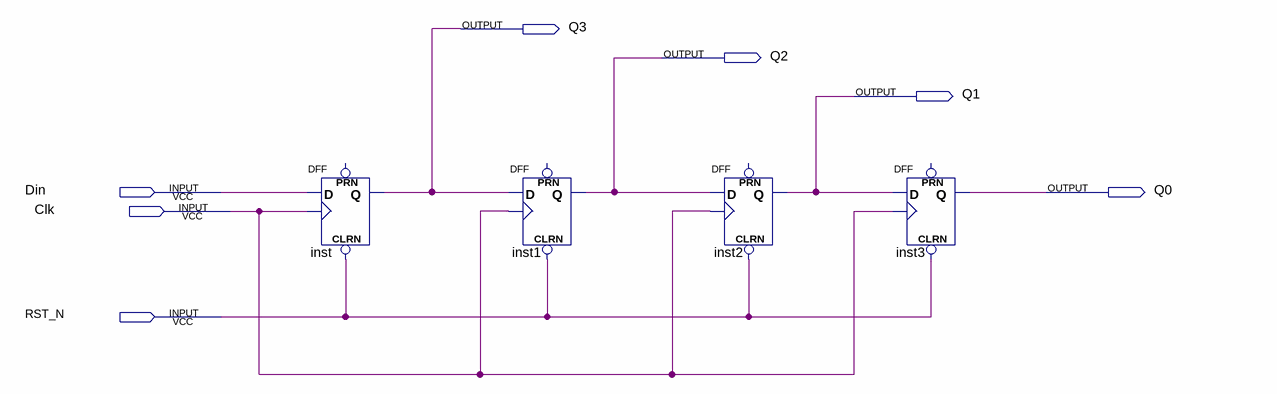
[diagram p0: schematic sheet]
// Quartus schematic week4_3_shift_register.bdf as structural Verilog: 4 symbols, 7 pins
module week4_3_shift_register (
  input  Din,
  input  Clk,
  input  RST_N,
  output Q3,
  output Q2,
  output Q1,
  output Q0
);

  DFF inst (.CLRN(RST_N), .CLK(Clk), .D(Din), .Q(Q3));  // open: PRN
  DFF inst1 (.CLRN(RST_N), .CLK(Clk), .D(Q3), .Q(Q2));  // open: PRN
  DFF inst2 (.CLRN(RST_N), .CLK(Clk), .D(Q2), .Q(Q1));  // open: PRN
  DFF inst3 (.CLRN(RST_N), .CLK(Clk), .D(Q1), .Q(Q0));  // open: PRN
endmodule
